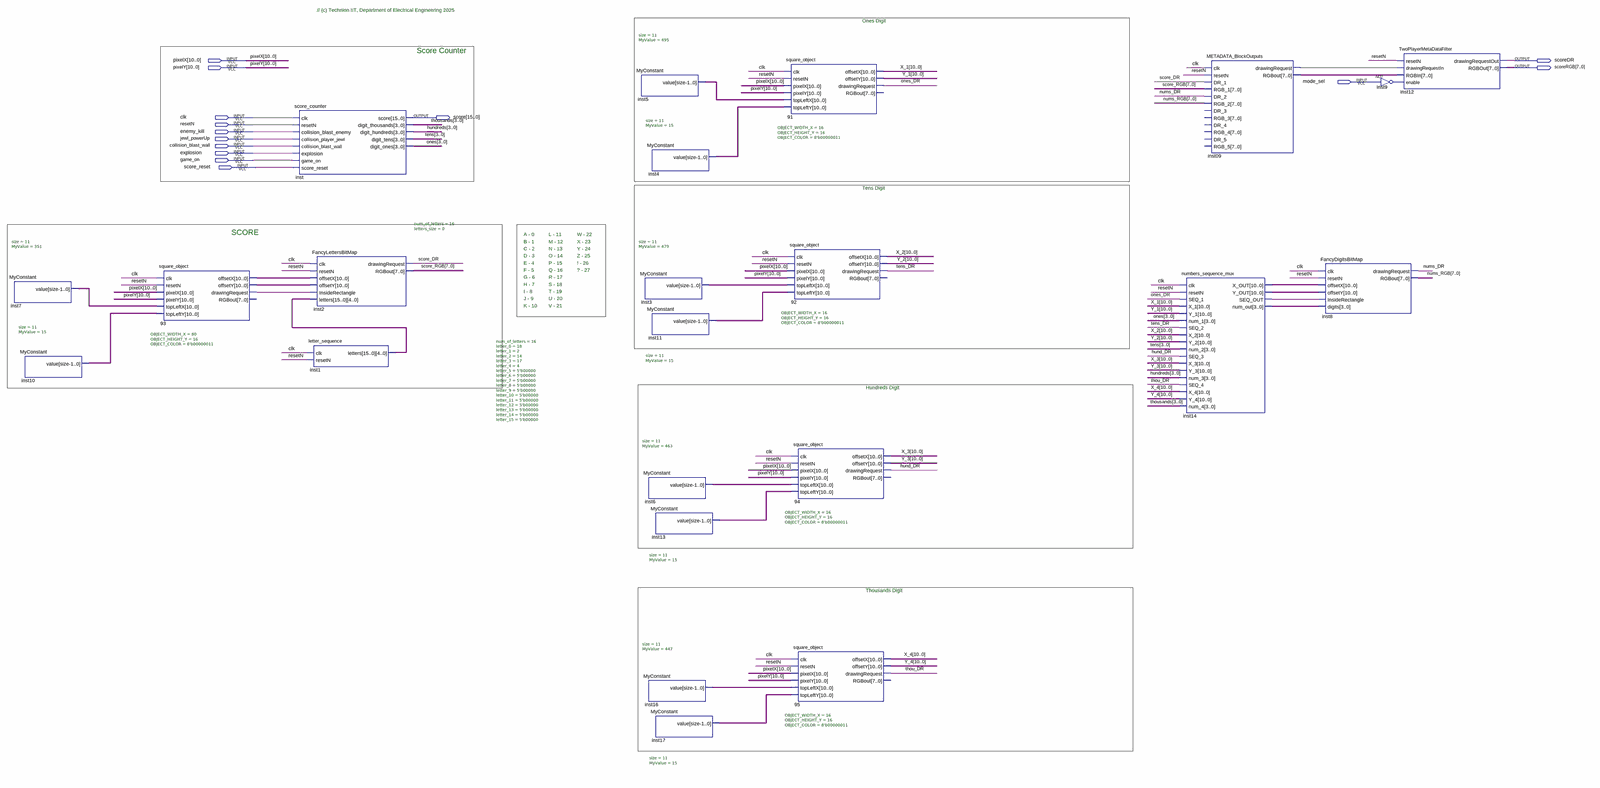
[diagram p0: schematic sheet, whole]
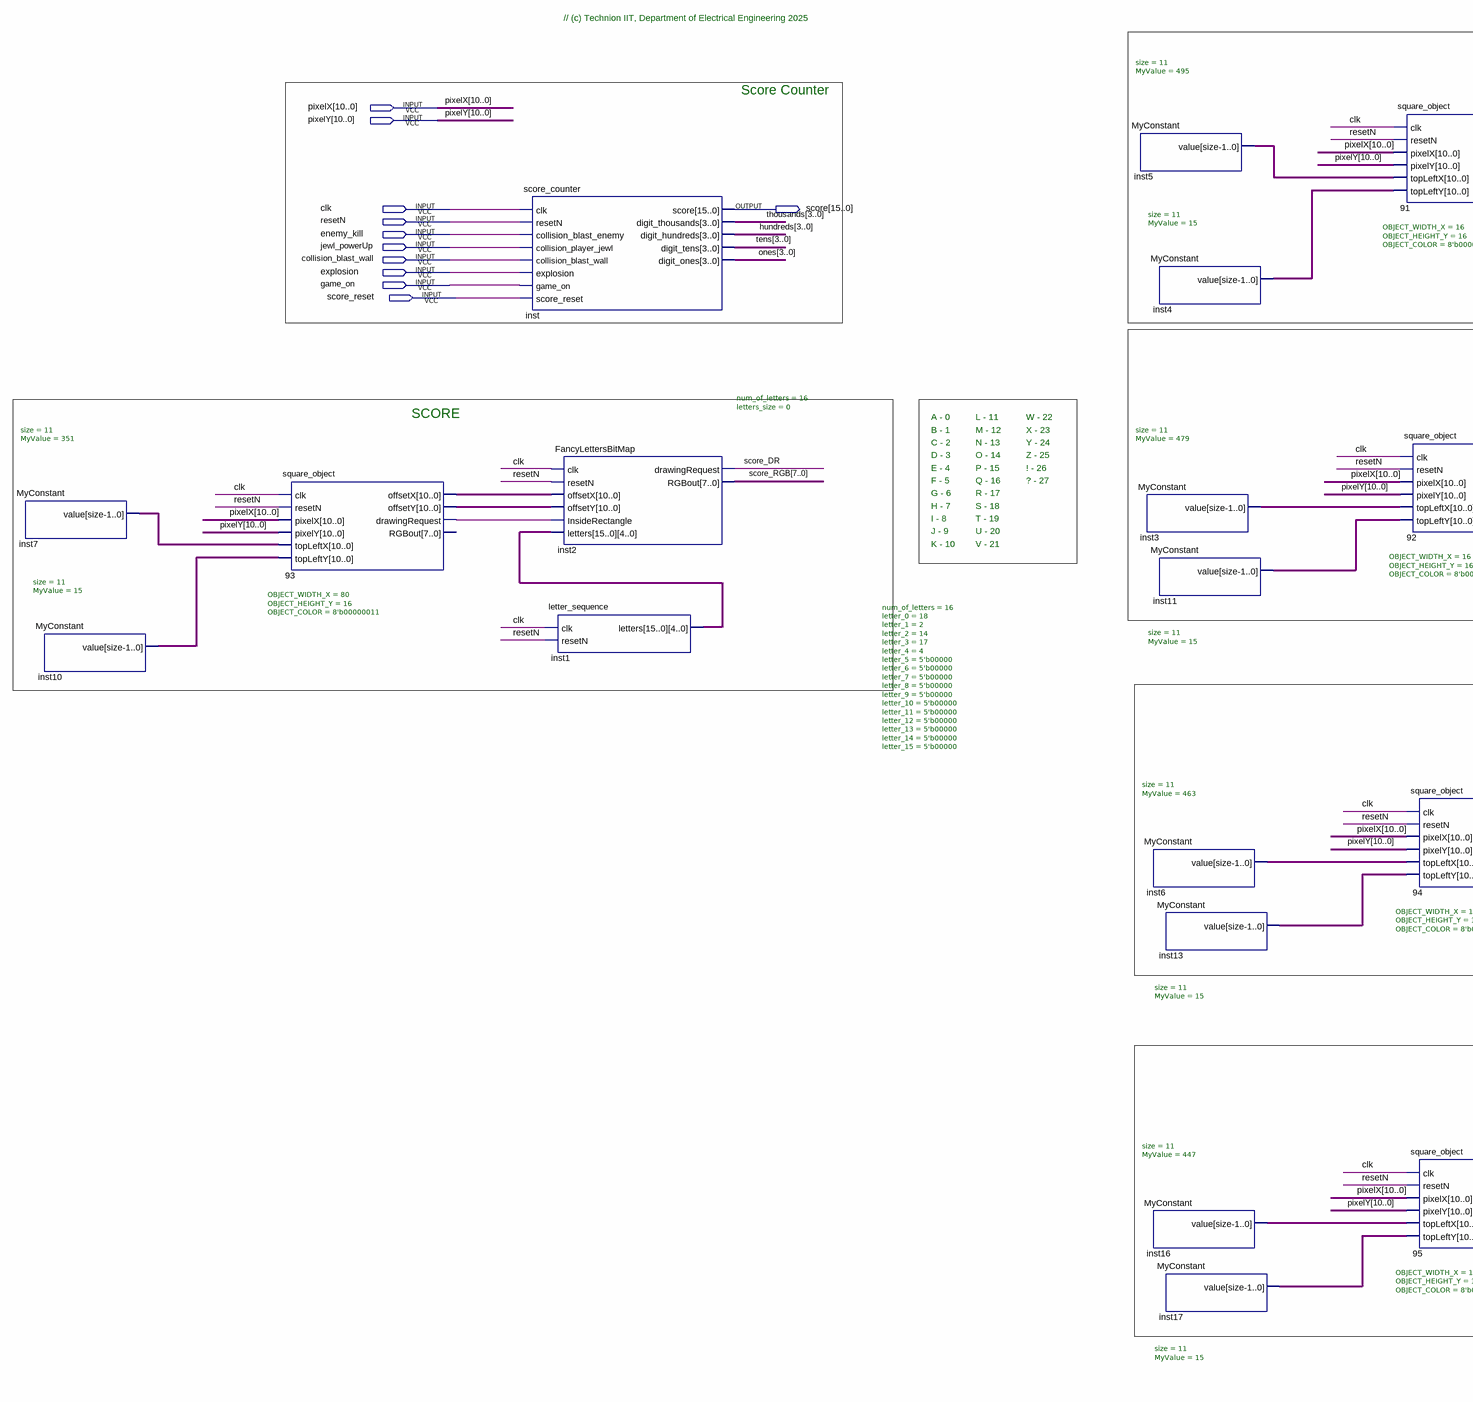
[diagram p1: schematic sheet, left part]
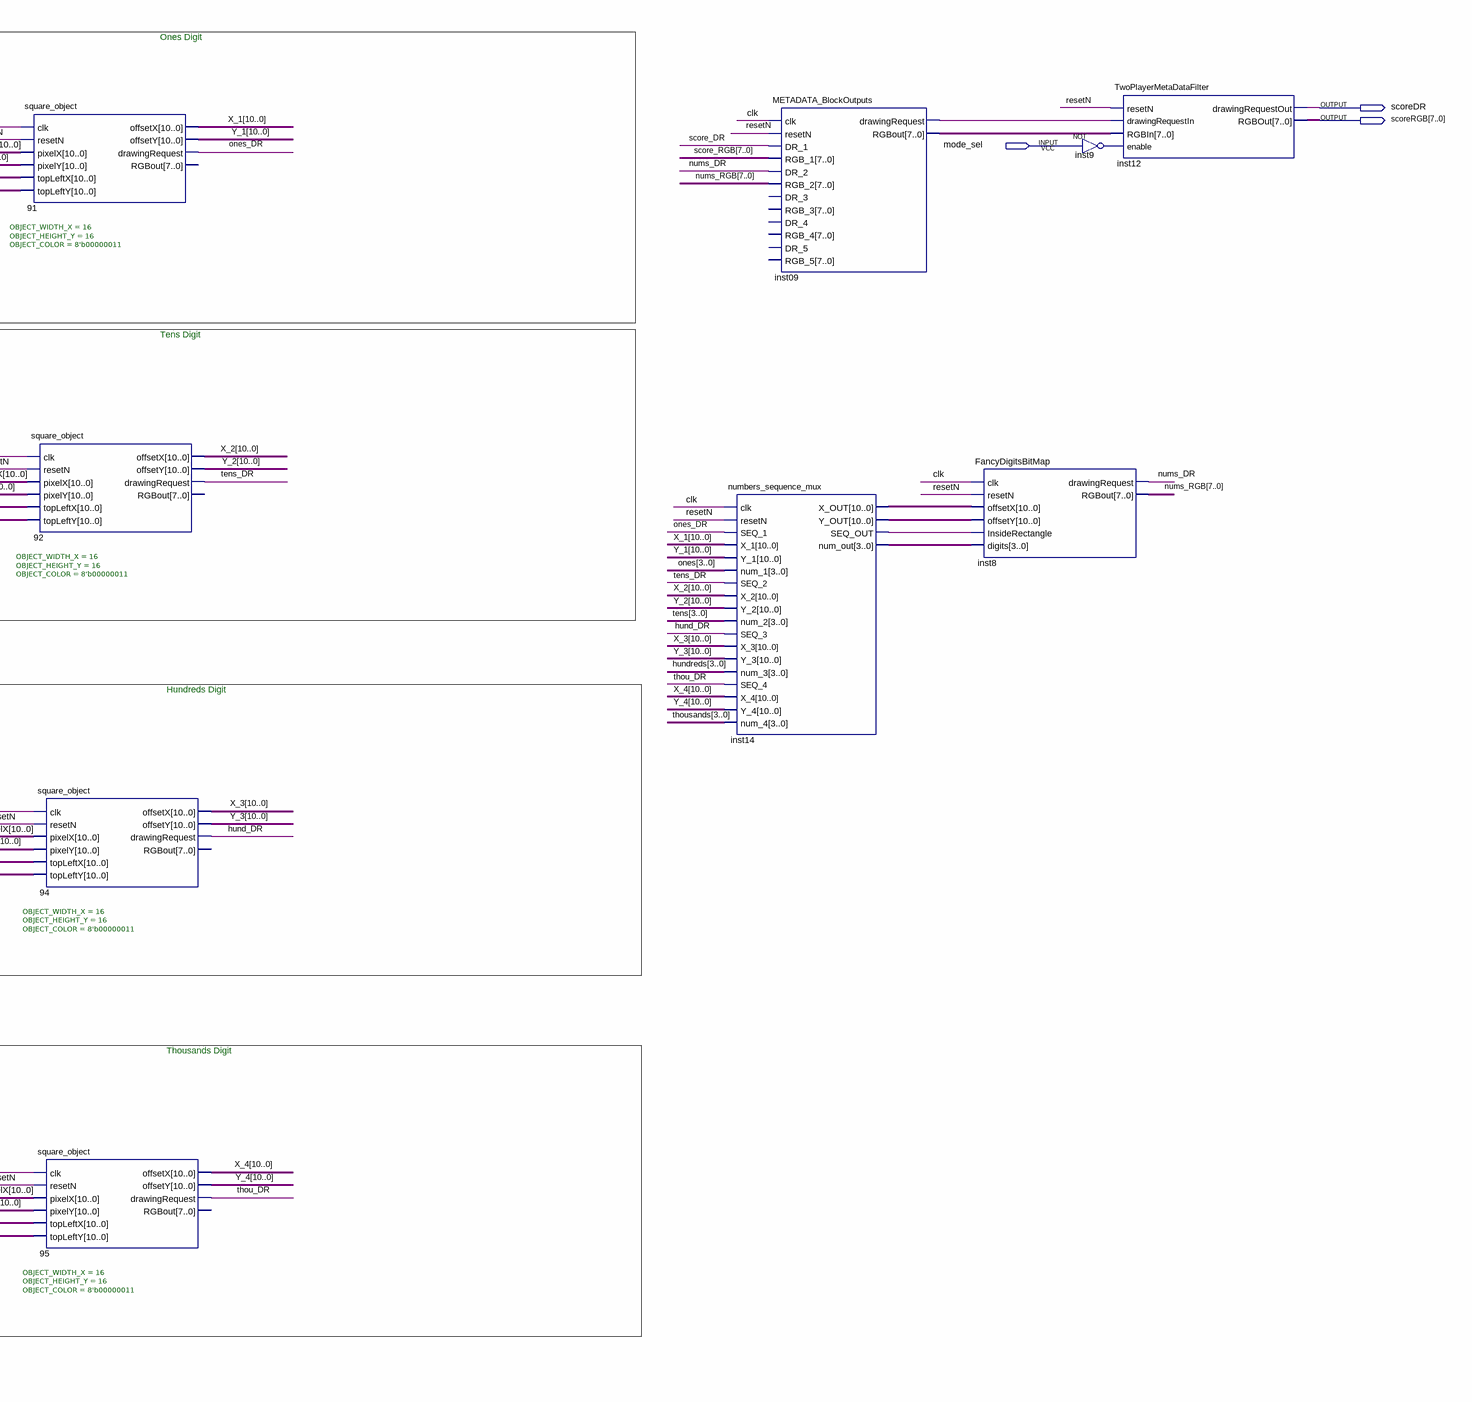
[diagram p2: schematic sheet, right part]
// Quartus schematic Score_Block.bdf as structural Verilog: 23 symbols, 14 pins
module Score_Block (
  input  [10:0] pixelX,
  input  [10:0] pixelY,
  input  mode_sel,
  input  clk,
  input  resetN,
  input  enemy_kill,
  input  jewl_powerUp,
  input  collision_blast_wall,
  input  explosion,
  input  game_on,
  input  score_reset,
  output scoreDR,
  output [7:0] scoreRGB,
  output [15:0] score
);

  wire hund_DR, inst09_drawingrequest, inst9_out, inst14_seq_out, n93_drawingrequest, nums_DR, ones_DR,
       score_DR, tens_DR, thou_DR;
  wire [3:0] hundreds, inst14_num_out, ones, tens, thousands;
  wire [7:0] inst09_rgbout, nums_RGB, score_RGB;
  wire [10:0] inst3_value, inst4_value, inst5_value, inst6_value, inst7_value, inst10_value, inst11_value,
       inst13_value, inst14_x_out, inst14_y_out, inst16_value, inst17_value, n93_offsetx, n93_offsety, X_1,
       X_2, X_3, X_4, Y_1, Y_2, Y_3, Y_4;
  wire [79:0] inst1_letters;

  MyConstant #(.size(11), .MyValue(351)) inst7 (.value(inst7_value));
  MyConstant #(.size(11), .MyValue(15)) inst10 (.value(inst10_value));
  square_object #(.OBJECT_WIDTH_X(80), .OBJECT_HEIGHT_Y(16), .OBJECT_COLOR(8'b00000011)) u_93 (
    .clk(clk), .resetN(resetN), .pixelX(pixelX), .pixelY(pixelY), .topLeftX(inst7_value),
    .topLeftY(inst10_value), .offsetX(n93_offsetx), .offsetY(n93_offsety), .drawingRequest(n93_drawingrequest));  // open: RGBout
  score_counter inst (
    .clk(clk), .resetN(resetN), .collision_blast_enemy(enemy_kill), .collision_player_jewl(jewl_powerUp),
    .collision_blast_wall(collision_blast_wall), .explosion(explosion), .game_on(game_on),
    .score_reset(score_reset), .score(score), .digit_thousands(thousands), .digit_hundreds(hundreds),
    .digit_tens(tens), .digit_ones(ones));
  FancyLettersBitMap #(.num_of_letters(16), .letters_size(0)) inst2 (
    .clk(clk), .resetN(resetN), .offsetX(n93_offsetx), .offsetY(n93_offsety),
    .InsideRectangle(n93_drawingrequest), .letters(inst1_letters), .drawingRequest(score_DR),
    .RGBout(score_RGB));
  letter_sequence #(.num_of_letters(16), .letter_0(18), .letter_1(2), .letter_2(14), .letter_3(17), .letter_4(4), .letter_5(5'b00000), .letter_6(5'b00000), .letter_7(5'b00000), .letter_8(5'b00000), .letter_9(5'b00000), .letter_10(5'b00000), .letter_11(5'b00000), .letter_12(5'b00000), .letter_13(5'b00000), .letter_14(5'b00000), .letter_15(5'b00000)) inst1 (
    .clk(clk), .resetN(resetN), .letters(inst1_letters));
  MyConstant #(.size(11), .MyValue(495)) inst5 (.value(inst5_value));
  MyConstant #(.size(11), .MyValue(479)) inst3 (.value(inst3_value));
  MyConstant #(.size(11), .MyValue(15)) inst4 (.value(inst4_value));
  MyConstant #(.size(11), .MyValue(15)) inst11 (.value(inst11_value));
  MyConstant #(.size(11), .MyValue(463)) inst6 (.value(inst6_value));
  MyConstant #(.size(11), .MyValue(15)) inst13 (.value(inst13_value));
  MyConstant #(.size(11), .MyValue(447)) inst16 (.value(inst16_value));
  MyConstant #(.size(11), .MyValue(15)) inst17 (.value(inst17_value));
  square_object #(.OBJECT_WIDTH_X(16), .OBJECT_HEIGHT_Y(16), .OBJECT_COLOR(8'b00000011)) u_91 (
    .clk(clk), .resetN(resetN), .pixelX(pixelX), .pixelY(pixelY), .topLeftX(inst5_value),
    .topLeftY(inst4_value), .offsetX(X_1), .offsetY(Y_1), .drawingRequest(ones_DR));  // open: RGBout
  square_object #(.OBJECT_WIDTH_X(16), .OBJECT_HEIGHT_Y(16), .OBJECT_COLOR(8'b00000011)) u_92 (
    .clk(clk), .resetN(resetN), .pixelX(pixelX), .pixelY(pixelY), .topLeftX(inst3_value),
    .topLeftY(inst11_value), .offsetX(X_2), .offsetY(Y_2), .drawingRequest(tens_DR));  // open: RGBout
  square_object #(.OBJECT_WIDTH_X(16), .OBJECT_HEIGHT_Y(16), .OBJECT_COLOR(8'b00000011)) u_94 (
    .clk(clk), .resetN(resetN), .pixelX(pixelX), .pixelY(pixelY), .topLeftX(inst6_value),
    .topLeftY(inst13_value), .offsetX(X_3), .offsetY(Y_3), .drawingRequest(hund_DR));  // open: RGBout
  square_object #(.OBJECT_WIDTH_X(16), .OBJECT_HEIGHT_Y(16), .OBJECT_COLOR(8'b00000011)) u_95 (
    .clk(clk), .resetN(resetN), .pixelX(pixelX), .pixelY(pixelY), .topLeftX(inst16_value),
    .topLeftY(inst17_value), .offsetX(X_4), .offsetY(Y_4), .drawingRequest(thou_DR));  // open: RGBout
  numbers_sequence_mux inst14 (
    .clk(clk), .resetN(resetN), .SEQ_1(ones_DR), .X_1(X_1), .Y_1(Y_1), .num_1(ones), .SEQ_2(tens_DR),
    .X_2(X_2), .Y_2(Y_2), .num_2(tens), .SEQ_3(hund_DR), .X_3(X_3), .Y_3(Y_3), .num_3(hundreds),
    .SEQ_4(thou_DR), .X_4(X_4), .Y_4(Y_4), .num_4(thousands), .X_OUT(inst14_x_out), .Y_OUT(inst14_y_out),
    .SEQ_OUT(inst14_seq_out), .num_out(inst14_num_out));
  METADATA_BlockOutputs inst09 (
    .clk(clk), .resetN(resetN), .DR_1(score_DR), .RGB_1(score_RGB), .DR_2(nums_DR), .RGB_2(nums_RGB),
    .drawingRequest(inst09_drawingrequest), .RGBout(inst09_rgbout));  // open: DR_3, RGB_3, DR_4, RGB_4, DR_5, RGB_5
  FancyDigitsBitMap inst8 (
    .clk(clk), .resetN(resetN), .offsetX(inst14_x_out), .offsetY(inst14_y_out),
    .InsideRectangle(inst14_seq_out), .digits(inst14_num_out), .drawingRequest(nums_DR), .RGBout(nums_RGB));
  not inst9 (inst9_out, mode_sel);
  TwoPlayerMetaDataFilter inst12 (
    .resetN(resetN), .drawingRequestIn(inst09_drawingrequest), .RGBIn(inst09_rgbout), .enable(inst9_out),
    .drawingRequestOut(scoreDR), .RGBOut(scoreRGB));

  // Notes on the sheet:
  //   // (c) Technion IIT, Department of Electrical Engineering 2025
  //   Ones Digit 
  //   Score Counter
  //   Tens Digit 
  //   SCORE
  //   A - 0
  //   L - 11
  //   W - 22
  //   B - 1
  //   M - 12
  //   X - 23
  //   C - 2
  //   N - 13
  //   Y - 24
  //   D - 3
  //   O - 14
  //   Z - 25
  //   E - 4
  //   P - 15
  //   ! - 26
  //   F - 5
  //   Q - 16
  //   ? - 27
  //   G - 6
  //   R - 17
  //   H - 7
  //   S - 18
  //   I - 8
  //   T - 19
  //   J - 9
  //   U - 20
  //   K - 10
  //   V - 21
  //   Hundreds Digit 
  //   Thousands Digit 
endmodule
